# Altium project 7-seg-display-2-digits.PrjPcb
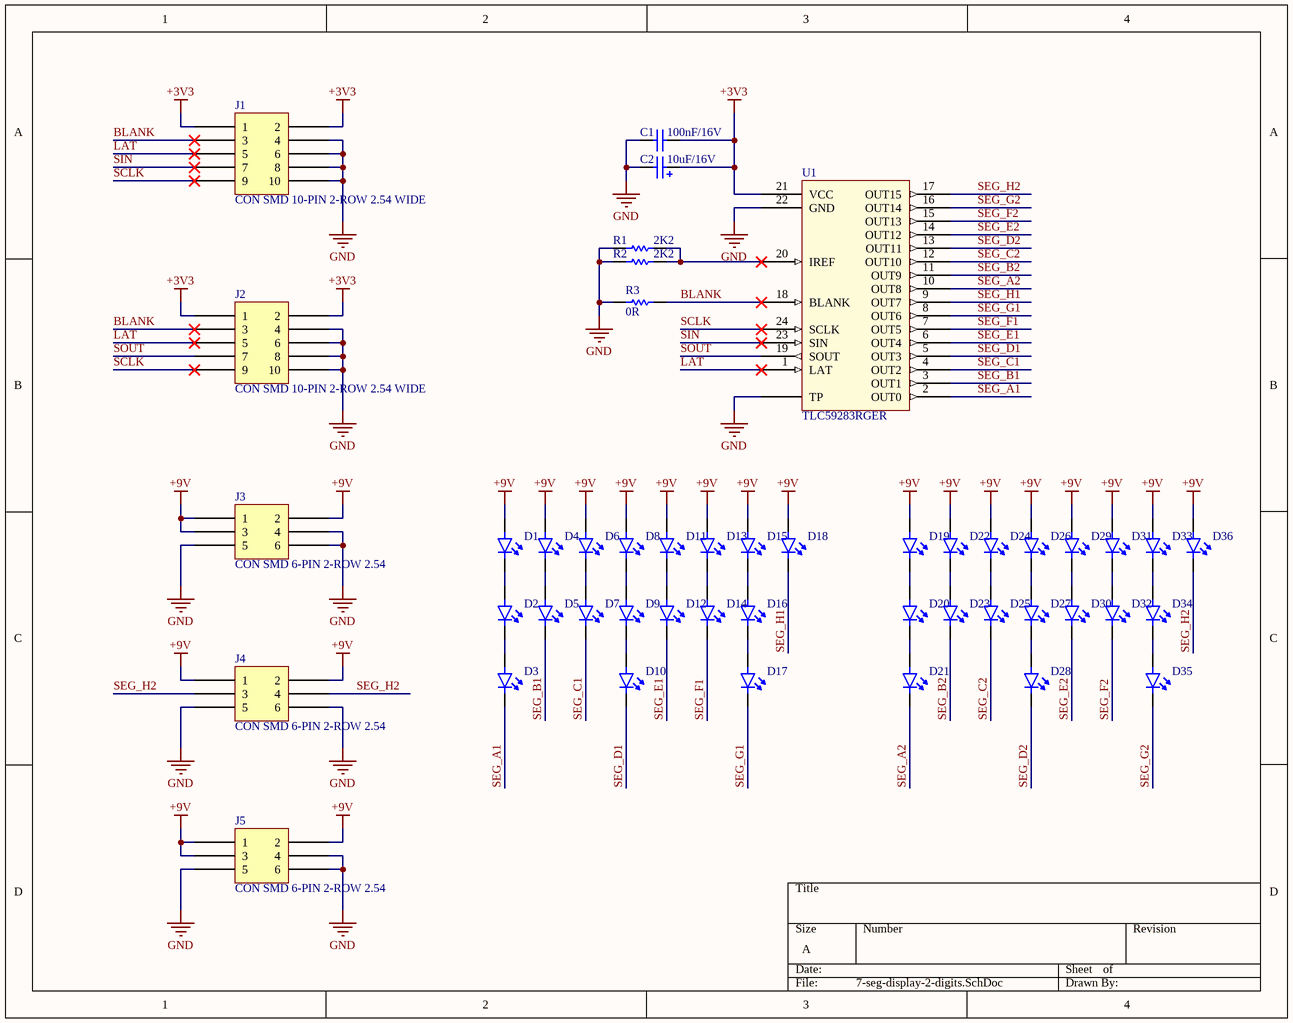
[diagram p0: 7-seg-display-2-digits.SchDoc]
1 sheet, 47 parts. Net scope: global (net labels, ports and power ports of the same name join across sheets).
Board file: 7-seg-display-2-digits.PcbDoc

## Sheet 7-seg-display-2-digits.SchDoc
size A

### Parts
C1  100nF/16V  [SMD 0603 GENERIC]
C2  10uF/16V  [SMD 1206 POLARIZED]
D1  OPT GEN LED 5MM  [THT LED 5MM]  (value not drawn)
D2  OPT GEN LED 5MM  [THT LED 5MM]  (value not drawn)
D3  OPT GEN LED 5MM  [THT LED 5MM]  (value not drawn)
D4  OPT GEN LED 5MM  [THT LED 5MM]  (value not drawn)
D5  OPT GEN LED 5MM  [THT LED 5MM]  (value not drawn)
D6  OPT GEN LED 5MM  [THT LED 5MM]  (value not drawn)
D7  OPT GEN LED 5MM  [THT LED 5MM]  (value not drawn)
D8  OPT GEN LED 5MM  [THT LED 5MM]  (value not drawn)
D9  OPT GEN LED 5MM  [THT LED 5MM]  (value not drawn)
D10  OPT GEN LED 5MM  [THT LED 5MM]  (value not drawn)
D11  OPT GEN LED 5MM  [THT LED 5MM]  (value not drawn)
D12  OPT GEN LED 5MM  [THT LED 5MM]  (value not drawn)
D13  OPT GEN LED 5MM  [THT LED 5MM]  (value not drawn)
D14  OPT GEN LED 5MM  [THT LED 5MM]  (value not drawn)
D15  OPT GEN LED 5MM  [THT LED 5MM]  (value not drawn)
D16  OPT GEN LED 5MM  [THT LED 5MM]  (value not drawn)
D17  OPT GEN LED 5MM  [THT LED 5MM]  (value not drawn)
D18  OPT GEN LED 5MM  [THT LED 5MM]  (value not drawn)
D19  OPT GEN LED 5MM  [THT LED 5MM]  (value not drawn)
D20  OPT GEN LED 5MM  [THT LED 5MM]  (value not drawn)
D21  OPT GEN LED 5MM  [THT LED 5MM]  (value not drawn)
D22  OPT GEN LED 5MM  [THT LED 5MM]  (value not drawn)
D23  OPT GEN LED 5MM  [THT LED 5MM]  (value not drawn)
D24  OPT GEN LED 5MM  [THT LED 5MM]  (value not drawn)
D25  OPT GEN LED 5MM  [THT LED 5MM]  (value not drawn)
D26  OPT GEN LED 5MM  [THT LED 5MM]  (value not drawn)
D27  OPT GEN LED 5MM  [THT LED 5MM]  (value not drawn)
D28  OPT GEN LED 5MM  [THT LED 5MM]  (value not drawn)
D29  OPT GEN LED 5MM  [THT LED 5MM]  (value not drawn)
D30  OPT GEN LED 5MM  [THT LED 5MM]  (value not drawn)
D31  OPT GEN LED 5MM  [THT LED 5MM]  (value not drawn)
D32  OPT GEN LED 5MM  [THT LED 5MM]  (value not drawn)
D33  OPT GEN LED 5MM  [THT LED 5MM]  (value not drawn)
D34  OPT GEN LED 5MM  [THT LED 5MM]  (value not drawn)
D35  OPT GEN LED 5MM  [THT LED 5MM]  (value not drawn)
D36  OPT GEN LED 5MM  [THT LED 5MM]  (value not drawn)
J1  CON SMD 10-PIN 2-ROW 2.54 WIDE  [SMD HEADER 2x5 2.54 WIDE]
J2  CON SMD 10-PIN 2-ROW 2.54 WIDE  [SMD HEADER 2x5 2.54 WIDE]
J3  CON SMD 6-PIN 2-ROW 2.54  [SMD HEADER 2x3 2.54]
J4  CON SMD 6-PIN 2-ROW 2.54  [SMD HEADER 2x3 2.54]
J5  CON SMD 6-PIN 2-ROW 2.54  [SMD HEADER 2x3 2.54]
R1  2K2  [SMD 0805 GENERIC]
R2  2K2  [SMD 0805 GENERIC]
R3  0R  [SMD 0603 GENERIC]
U1  TLC59283RGER  [VQFN-24]

### Nets
+3V3: C1.2 C2.1 J1.1 J1.2 J2.1 J2.2 U1.21(VCC)
+9V: D1.A D4.A D6.A D8.A D11.A D13.A D15.A D18.A D19.A D22.A D24.A D26.A D29.A D31.A D33.A D36.A J3.1 J3.2 J3.3 J4.1 J4.2 J5.1 J5.2 J5.3
GND: C1.1 C2.2 J1.4 J1.6 J1.8 J1.10 J2.4 J2.6 J2.8 J2.10 J3.4 J3.5 J3.6 J4.5 J4.6 J5.4 J5.5 J5.6 R1.1 R2.1 R3.2 U1.22(GND) U1.25(TP)
BLANK: J1.3 J2.3 R3.1 U1.18(BLANK)
LAT: J1.5 J2.5 U1.1(LAT)
SCLK: J1.9 J2.9 U1.24(SCLK)
SEG_A1: D3.K U1.2(OUT0)
SEG_A2: D21.K U1.10(OUT8)
SEG_B1: D5.K U1.3(OUT1)
SEG_B2: D23.K U1.11(OUT9)
SEG_C1: D7.K U1.4(OUT2)
SEG_C2: D25.K U1.12(OUT10)
SEG_D1: D10.K U1.5(OUT3)
SEG_D2: D28.K U1.13(OUT11)
SEG_E1: D12.K U1.6(OUT4)
SEG_E2: D30.K U1.14(OUT12)
SEG_F1: D14.K U1.7(OUT5)
SEG_F2: D32.K U1.15(OUT13)
SEG_G1: D17.K U1.8(OUT6)
SEG_G2: D35.K U1.16(OUT14)
SEG_H1: D18.K U1.9(OUT7)
SEG_H2: D36.K J4.3 J4.4 U1.17(OUT15)
SIN: J1.7 U1.23(SIN)
SOUT: J2.7 U1.19(SOUT)
NetD1_K: D1.K D2.A
NetD2_K: D2.K D3.A
NetD4_K: D4.K D5.A
NetD6_K: D6.K D7.A
NetD8_K: D8.K D9.A
NetD9_K: D9.K D10.A
NetD11_K: D11.K D12.A
NetD13_K: D13.K D14.A
NetD15_K: D15.K D16.A
NetD16_K: D16.K D17.A
NetD19_K: D19.K D20.A
NetD20_K: D20.K D21.A
NetD22_K: D22.K D23.A
NetD24_K: D24.K D25.A
NetD26_K: D26.K D27.A
NetD27_K: D27.K D28.A
NetD29_K: D29.K D30.A
NetD31_K: D31.K D32.A
NetD33_K: D33.K D34.A
NetD34_K: D34.K D35.A
NetR1_2: R1.2 R2.2 U1.20(IREF)

### Library data of the parts
C1 = CAP SMD CER 100nF 16V 10% X7R 0603
C2 = CAP SMD TAN 10uF 16V 10% 1206
J1 J2 = CON SMD 10-PIN 2-ROW 2.54 WIDE: HTST-105-01-SM-DV-P
R1 R2 = RES SMD 2K2 1% 0805
R3 = RES SMD 0R 0603
U1 = LED DRV 16-CH TLC59283RGER